# Altium schematic sheet Neg5V.SchDoc
size A
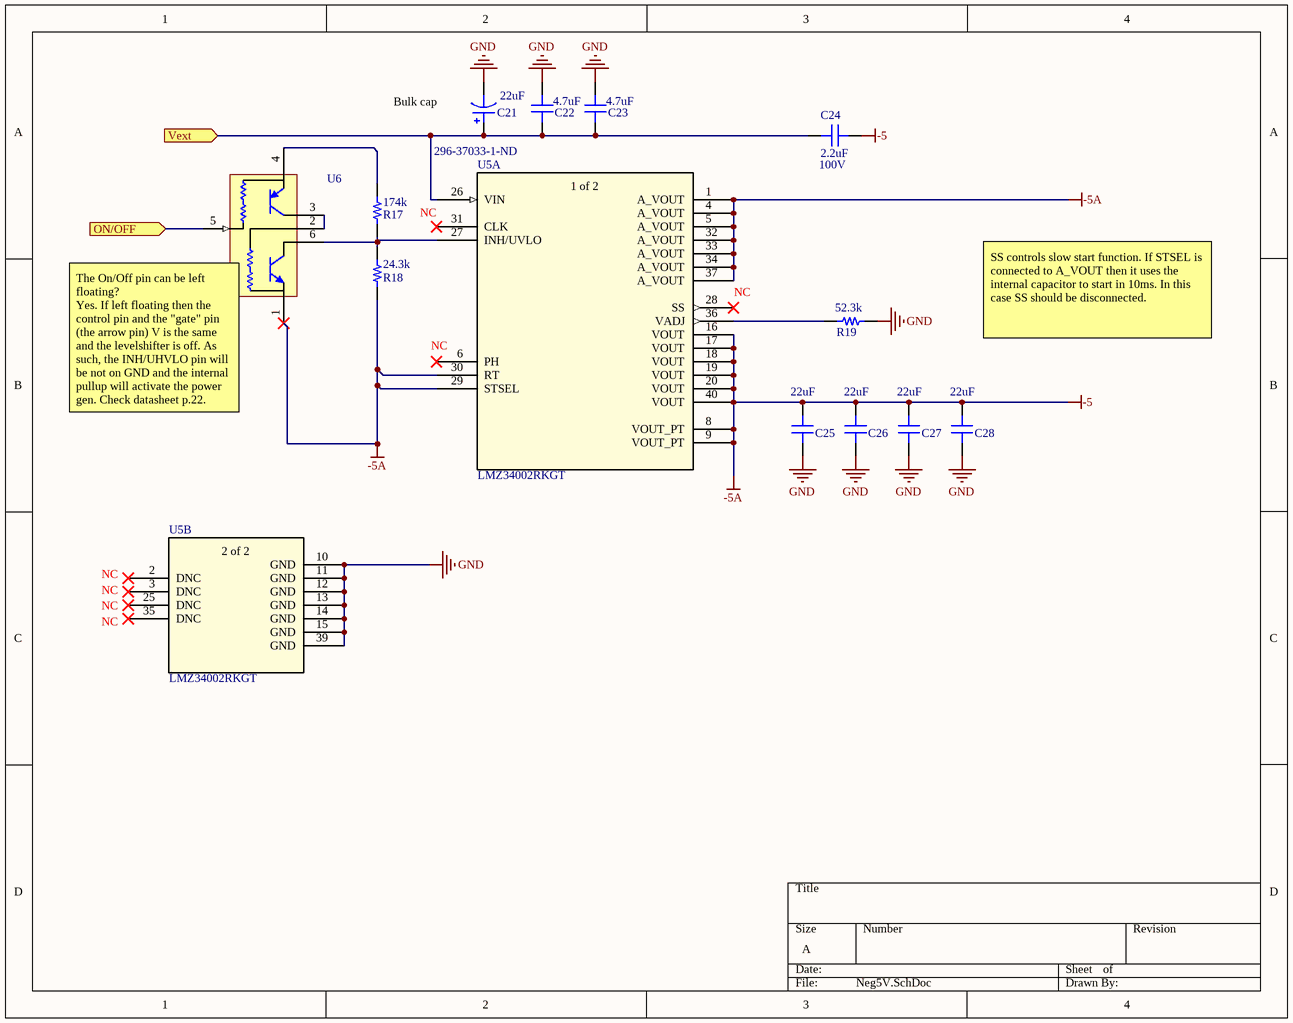
[diagram p0: Neg5V.SchDoc]

## Parts
C21  22uF  [CAP AL TH D8 L3.5 H11.5]
C22  4.7uF  [CAP 1206/3216 - 1.0MM]
C23  4.7uF  [CAP 1206/3216 - 1.0MM]
C24  2.2uF  [CAP 1206/3216]
C25  22uF  [CAP 1206/3216]
C26  22uF  [CAP 1206/3216]
C27  22uF  [CAP 1206/3216]
C28  22uF  [CAP 1206/3216]
R17  174k  [RES 0805/2012]
R18  24.3k  [RES 0805/2012]
R19  52.3k  [RES 0805/2012]
U5  LMZ34002RKGT  Supplier Part Number 1: 296-37033-1-ND  [RKG41]  (parts A,B of 2)
U6  DCX144EH-7  [SOT-563]  (value not drawn)

## Ports
ON/OFF (in), Vext (in)

## Nets
-5: C24.1 C25.2 C26.2 C27.2 C28.2 R18.1 U5.1(A_VOUT) U5.4(A_VOUT) U5.5(A_VOUT) U5.8(VOUT_PT) U5.9(VOUT_PT) U5.16(VOUT) U5.17(VOUT) U5.18(VOUT) U5.19(VOUT) U5.20(VOUT) U5.29(STSEL) U5.30(RT) U5.32(A_VOUT) U5.33(A_VOUT) U5.34(A_VOUT) U5.37(A_VOUT) U5.40(VOUT) U6.1  [also labelled -5A]
GND: C21.2 C22.2 C23.2 C25.1 C26.1 C27.1 C28.1 R19.2 U5.10(GND) U5.11(GND) U5.12(GND) U5.13(GND) U5.14(GND) U5.15(GND) U5.39(GND)
ON/OFF: U6.5 ; port ON/OFF
Vext: C21.1 C22.1 C23.1 C24.2 U5.26(VIN) ; port Vext
NetR17_1: R17.1 R18.2 U5.27(INH/UVLO) U6.6
NetR17_2: R17.2 U6.4
NetR19_1: R19.1 U5.36(VADJ)
NetU6_2: U6.2 U6.3

Not connected (* = marked no-connect by the designer): U5 2(DNC)* 3(DNC)* 6(PH)* 25(DNC)* 28(SS)* 31(CLK)* 35(DNC)*

## Notes on the sheet
- (near C21) Bulk cap
- (near C24) 100V
- NC
- (near U5) NC
- SS controls slow start function. If STSEL is connected to A_VOUT then it uses the internal capacitor to start in 10ms. In this case SS should be disconnected.
- (near U6) The On/Off pin can be left floating?
  Yes. If left floating then the control pin and the "gate" pin (the arrow pin) V is the same and the levelshifter is off. As such, the INH/UHVLO pin will be not on GND and the internal pullup will activate the power gen. Check datasheet p.22.
- (in symbol LMZ34002RKGT, part A) 1 of 2
- (in symbol LMZ34002RKGT, part B) 2 of 2

## Library data of the parts
C21 = EEU-FC2A220: CAP ALUM 22UF 20% 100V RADIAL; Manufacturer: Panasonic Electronic Components; TemperatureRange: -55°C ~ 105°C; Type: Automotive; Ripple Current: 169mA; Lifetime @ Temp: 2000 Hrs @ 105°C; Value: 22uF; Part Number: EEU-FC2A220; PartId: 7484; Supplier 1: Digi-Key; Supplier Part Number 1: P10770-ND; ComponentLink1Description: Datasheet; ComponentLink1URL: https://industrial.panasonic.com/ww/products/capacitors/aluminum-capacitors/aluminum-cap-lead/fc/EEUFC2A220; ComponentLink2Description: Digi-Key listing; ComponentLink2URL: https://www.digikey.com/product-detail/en/panasonic-electronic-components/EEU-FC2A220/P10770-ND/285722; Tolerance: 20%; Voltage: 100V; Price: 0.46; Device Package: Radial, Can - TH
C22 C23 = C3216X5R1H475K085AB: CAP CER 4.7UF 50V X5R 1206; Manufacturer: TDK Corporation; TemperatureRange: -55C ~ 85C; Tolerance: 10%; Value: 4.7uF; Part Number: C3216X5R1H475K085AB; PartId: 17022; Supplier 1: Digi-Key; Supplier Part Number 1: 445-14692-2-ND; ComponentLink1Description: Datasheet; ComponentLink1URL: https://product.tdk.com/info/en/catalog/datasheets/mlcc_commercial_general_en.pdf; ComponentLink2Description: Digi-Key Listing; ComponentLink2URL: https://www.digikey.com/product-detail/en/tdk-corporation/C3216X5R1H475K085AB/445-14692-2-ND/3951928; TemperatureCoefficient: X5R; Voltage: 50V; Price: 0.3159; Device Package: 1206 (3216 Metric)
C24 = CL31B225KCHSNNE: CAP CER 2.2UF 100V X7R 1206; Manufacturer: Samsung Electro-Mechanics America, Inc.; TemperatureRange: -55C ~ 125C; Tolerance: 10%; Value: 2.2uF; Part Number: CL31B225KCHSNNE; PartId: 6260; Supplier 1: Digi-Key; Supplier Part Number 1: 1276-3138-2-ND; ComponentLink1Description: Datasheet; ComponentLink1URL: http://media.digikey.com/pdf/Data%20Sheets/Samsung%20PDFs/CL31B225KCHSNNE_Spec.pdf; ComponentLink2Description: Digi-Key listing; ComponentLink2URL: http://digikey.com/product-detail/en/CL31B225KCHSNNE/1276-3138-2-ND/3888796; TemperatureCoefficient: X7R; Voltage: 100V; Price: 0.3227; Type: -; Device Package: 1206 (3216 Metric)
C25-C28 = CL31A226KAHNNNE: CAP CER 22UF 25V X5R 1206; Manufacturer: Samsung Electro-Mechanics America, Inc.; TemperatureRange: -55C ~ 85C; Tolerance: 10%; Value: 22uF; Part Number: CL31A226KAHNNNE; PartId: 15794; Supplier 1: Digi-Key; Supplier Part Number 1: 1276-3047-2-ND; ComponentLink1Description: Datasheet; ComponentLink1URL: //media.digikey.com/pdf/Data%20Sheets/Samsung%20PDFs/CL31A226KAHNNNE_Spec.pdf; ComponentLink2Description: Digi-Key Listing; ComponentLink2URL: https://www.digikey.com/product-detail/en/samsung-electro-mechanics-america-inc/CL31A226KAHNNNE/1276-3047-2-ND/3888705; TemperatureCoefficient: X5R; Voltage: 25V; Price: 0.1785; Device Package: 1206 (3216 Metric)
R17 = ERJ-6ENF1743V: RES SMD 174K OHM 1% 1/8W 0805; Manufacturer: Panasonic Electronic Components; TemperatureRange: -55C ~ 155C; TemperatureCoefficient: 100ppm/C; PowerRating: 0.125W, 1/8W; Value: 174k; Part Number: ERJ-6ENF1743V; PartId: 2344; Supplier 1: Digi-Key; Supplier Part Number 1: P174KCTR-ND; ComponentLink1Description: Datasheet; ComponentLink1URL: http://industrial.panasonic.com/www-cgi/jvcr13pz.cgi?E+PZ+3+AOA0002+ERJ6ENF1743V+7+WW; ComponentLink2Description: Digi-Key listing; ComponentLink2URL: http://digikey.com/product-detail/en/ERJ-6ENF1743V/P174KCTR-ND/111921; Tolerance: 1%; Price: 0.0073; Type: Thick Film; Device Package: 0805 (2012 Metric)
R18 = ERJ-6ENF2432V: RES SMD 24.3K OHM 1% 1/8W 0805; Manufacturer: Panasonic Electronic Components; TemperatureRange: -55C ~ 155C; TemperatureCoefficient: 100ppm/C; PowerRating: 0.125W, 1/8W; Value: 24.3k; Part Number: ERJ-6ENF2432V; PartId: 2331; Supplier 1: Digi-Key; Supplier Part Number 1: P24.3KCTR-ND; ComponentLink1Description: Datasheet; ComponentLink1URL: http://industrial.panasonic.com/www-cgi/jvcr13pz.cgi?E+PZ+3+AOA0002+ERJ6ENF2432V+7+WW; ComponentLink2Description: Digi-Key listing; ComponentLink2URL: http://digikey.com/product-detail/en/ERJ-6ENF2432V/P24.3KCTR-ND/111548; Tolerance: 1%; Price: 0.0073; Type: Thick Film; Device Package: 0805 (2012 Metric)
R19 = ERJ-6ENF5232V: RES SMD 52.3K OHM 1% 1/8W 0805; Manufacturer: Panasonic Electronic Components; TemperatureRange: -55C ~ 155C; TemperatureCoefficient: 100ppm/C; PowerRating: 0.125W, 1/8W; Value: 52.3k; Part Number: ERJ-6ENF5232V; PartId: 2052; Supplier 1: Digi-Key; Supplier Part Number 1: P52.3KCTR-ND; ComponentLink1Description: Datasheet; ComponentLink1URL: http://industrial.panasonic.com/www-cgi/jvcr13pz.cgi?E+PZ+3+AOA0002+ERJ6ENF5232V+7+WW; ComponentLink2Description: Digi-Key listing; ComponentLink2URL: http://digikey.com/product-detail/en/ERJ-6ENF5232V/P52.3KCTR-ND/111615; Tolerance: 1%; Price: 0.0073; Type: Thick Film; Device Package: 0805 (2012 Metric)
U5 = LMZ34002RKGT: No Description Available; Vendor: Texas Instruments; Built_By: EMA_UL_Team; Manufacturer_Part_Number: LMZ34002RKGT; Copyright: Copyright (C) 2018 Accelerated Designs. All rights reserved; RefDes: RefDes; Type: DEV; Value: Value; Supplier 1: Digi-Key
U6 = DCX144EH-7: TRANS PREBIAS NPN/PNP SOT563; Manufacturer: Diodes Incorporated; Power - Max: 150mW; Part Number: DCX144EH-7; PartId: 9696; Supplier 1: Digi-Key; Supplier Part Number 1: DCX144EH-7DICT-ND; ComponentLink1Description: Datasheet; ComponentLink1URL: https://www.diodes.com/assets/Datasheets/ds30422.pdf; ComponentLink2Description: Digi-Key Listing; ComponentLink2URL: https://www.digikey.com/product-detail/en/diodes-incorporated/DCX144EH-7/DCX144EH-7DICT-ND/5218295; Price: 0.42; Type: 1 NPN, 1 PNP - Pre-Biased (Dual); Device Package: SOT-563, SOT-666